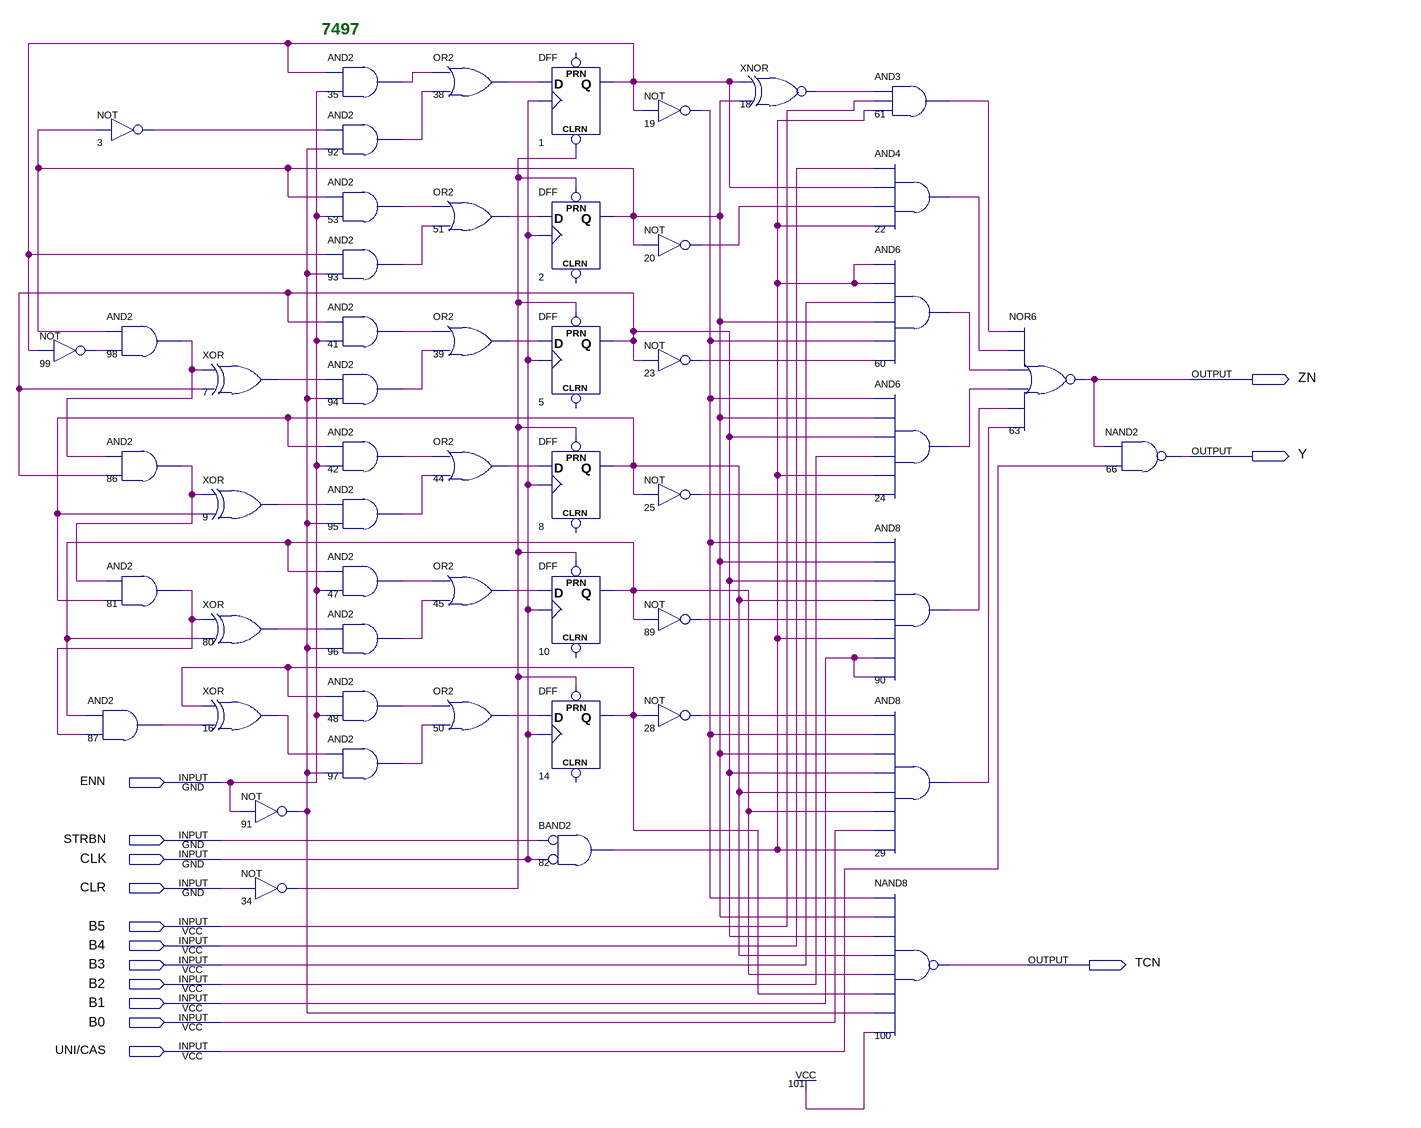
[diagram p0: schematic sheet]
// Quartus schematic 7497.bdf as structural Verilog: 53 symbols, 14 pins
module \7497  (
  input  ENN,
  input  STRBN,
  input  CLK,
  input  CLR,
  input  B5,
  input  B4,
  input  B3,
  input  B2,
  input  B1,
  input  B0,
  input  \UNI/CAS ,
  output ZN,
  output Y,
  output TCN
);

  wire n1_q, n2_q, n3_out, n5_q, n7_out, n8_q, n9_out, n10_q, n14_q, n16_out, n18_out, n19_out, n20_out,
       n22_out, n23_out, n24_out, n25_out, n28_out, n29_out, n34_out, n35_out, n38_out, n39_out, n41_out,
       n42_out, n44_out, n45_out, n47_out, n48_out, n50_out, n51_out, n53_out, n60_out, n61_out, n80_out,
       n81_out, n82_out, n86_out, n87_out, n89_out, n90_out, n91_out, n92_out, n93_out, n94_out, n95_out,
       n96_out, n97_out, n98_out, n99_out;

  not u_99 (n99_out, n1_q);
  not u_3 (n3_out, n2_q);
  and u_98 (n98_out, n2_q, n99_out);
  and u_86 (n86_out, n98_out, n5_q);
  and u_81 (n81_out, n86_out, n8_q);
  and u_87 (n87_out, n10_q, n81_out);
  xor u_7 (n7_out, n98_out, n5_q);
  xor u_9 (n9_out, n86_out, n8_q);
  xor u_80 (n80_out, n81_out, n10_q);
  xor u_16 (n16_out, n14_q, n87_out);
  not u_91 (n91_out, ENN);
  not u_34 (n34_out, CLR);
  and u_35 (n35_out, n1_q, ENN);
  and u_92 (n92_out, n3_out, n91_out);
  and u_53 (n53_out, n2_q, ENN);
  and u_93 (n93_out, n1_q, n91_out);
  and u_41 (n41_out, n5_q, ENN);
  and u_94 (n94_out, n7_out, n91_out);
  and u_42 (n42_out, n8_q, ENN);
  and u_95 (n95_out, n9_out, n91_out);
  and u_47 (n47_out, n10_q, ENN);
  and u_96 (n96_out, n80_out, n91_out);
  and u_48 (n48_out, n14_q, ENN);
  and u_97 (n97_out, n16_out, n91_out);
  or u_38 (n38_out, n35_out, n92_out);
  or u_51 (n51_out, n53_out, n93_out);
  or u_39 (n39_out, n41_out, n94_out);
  or u_44 (n44_out, n42_out, n95_out);
  or u_45 (n45_out, n47_out, n96_out);
  or u_50 (n50_out, n48_out, n97_out);
  DFF u_1 (.CLRN(n34_out), .CLK(CLK), .D(n38_out), .Q(n1_q));  // open: PRN
  DFF u_2 (.CLK(CLK), .D(n51_out), .PRN(n34_out), .Q(n2_q));  // open: CLRN
  DFF u_5 (.CLK(CLK), .D(n39_out), .PRN(n34_out), .Q(n5_q));  // open: CLRN
  DFF u_8 (.CLK(CLK), .D(n44_out), .PRN(n34_out), .Q(n8_q));  // open: CLRN
  DFF u_10 (.CLK(CLK), .D(n45_out), .PRN(n34_out), .Q(n10_q));  // open: CLRN
  DFF u_14 (.CLK(CLK), .D(n50_out), .PRN(n34_out), .Q(n14_q));  // open: CLRN
  and u_82 (n82_out, ~STRBN, ~CLK);  // BAND2
  not u_19 (n19_out, n1_q);
  not u_20 (n20_out, n2_q);
  not u_23 (n23_out, n5_q);
  not u_25 (n25_out, n8_q);
  not u_89 (n89_out, n10_q);
  not u_28 (n28_out, n14_q);
  xnor u_18 (n18_out, n1_q, n2_q);
  and u_61 (n61_out, n18_out, B5, n82_out);
  and u_22 (n22_out, B4, n1_q, n20_out, n82_out);
  and u_60 (n60_out, n82_out, n82_out, B3, n2_q, n19_out, n23_out);
  and u_24 (n24_out, n19_out, n2_q, n5_q, B2, n82_out, n25_out);
  and u_90 (n90_out, n19_out, n2_q, n5_q, n8_q, n89_out, n82_out, B1, B1);
  and u_29 (n29_out, n28_out, n19_out, n2_q, n5_q, n8_q, n10_q, B0, n82_out);
  nand u_100 (TCN, n19_out, n2_q, n5_q, n8_q, n10_q, n14_q, n91_out, 1'b1);
  nor u_63 (ZN, n61_out, n22_out, n60_out, n24_out, n90_out, n29_out);
  nand u_66 (Y, ZN, \UNI/CAS );

  // Notes on the sheet:
  //   7497
endmodule
